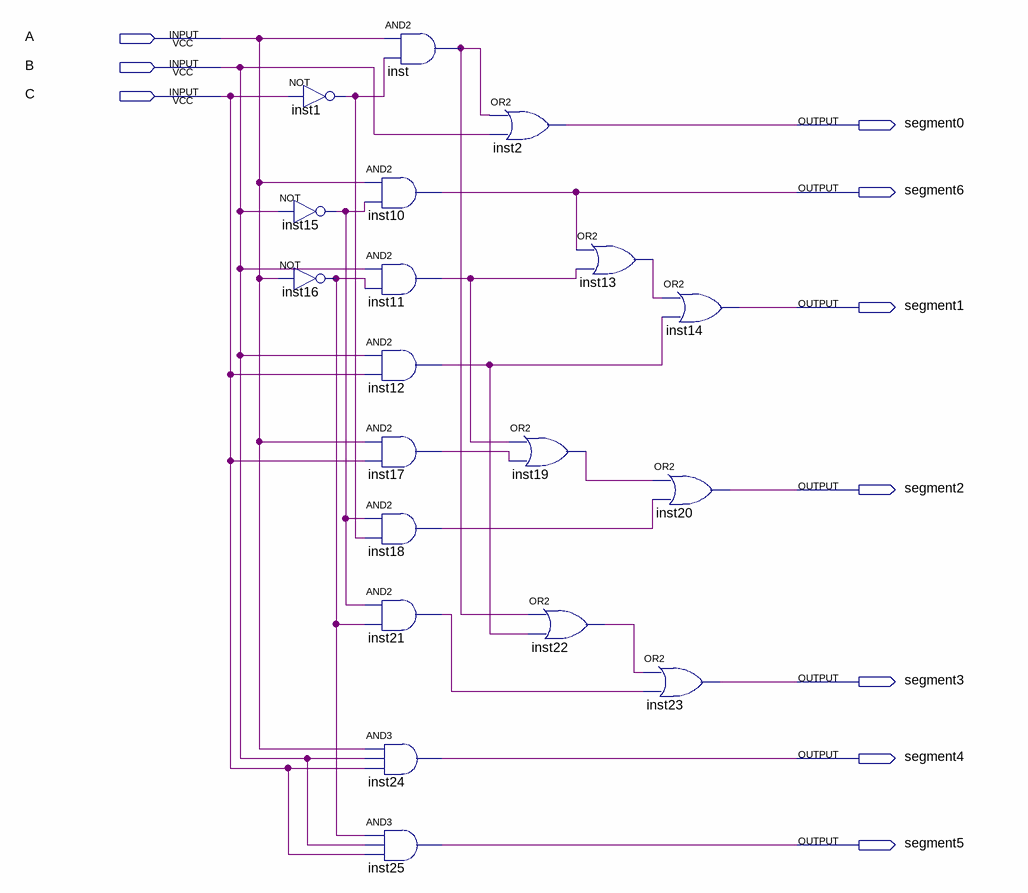
[diagram p0: schematic sheet]
// Quartus schematic week2.bdf as structural Verilog: 19 symbols, 10 pins
module week2 (
  input  A,
  input  B,
  input  C,
  output segment0,
  output segment6,
  output segment1,
  output segment2,
  output segment3,
  output segment4,
  output segment5
);

  wire inst1_out, inst11_out, inst12_out, inst13_out, inst15_out, inst16_out, inst17_out, inst18_out,
       inst19_out, inst21_out, inst22_out, inst_out;

  not inst1 (inst1_out, C);
  not inst15 (inst15_out, B);
  not inst16 (inst16_out, A);
  and inst (inst_out, A, inst1_out);
  and inst10 (segment6, A, inst15_out);
  and inst11 (inst11_out, B, inst16_out);
  and inst12 (inst12_out, B, C);
  and inst17 (inst17_out, A, C);
  and inst18 (inst18_out, inst15_out, inst1_out);
  and inst21 (inst21_out, inst15_out, inst16_out);
  and inst24 (segment4, A, B, C);
  and inst25 (segment5, inst16_out, B, C);
  or inst2 (segment0, inst_out, B);
  or inst19 (inst19_out, inst11_out, inst17_out);
  or inst22 (inst22_out, inst_out, inst12_out);
  or inst13 (inst13_out, segment6, inst11_out);
  or inst14 (segment1, inst13_out, inst12_out);
  or inst20 (segment2, inst19_out, inst18_out);
  or inst23 (segment3, inst22_out, inst21_out);
endmodule
